# EAGLE design fb_relais_8_230V_83a (EAGLE 5.01)
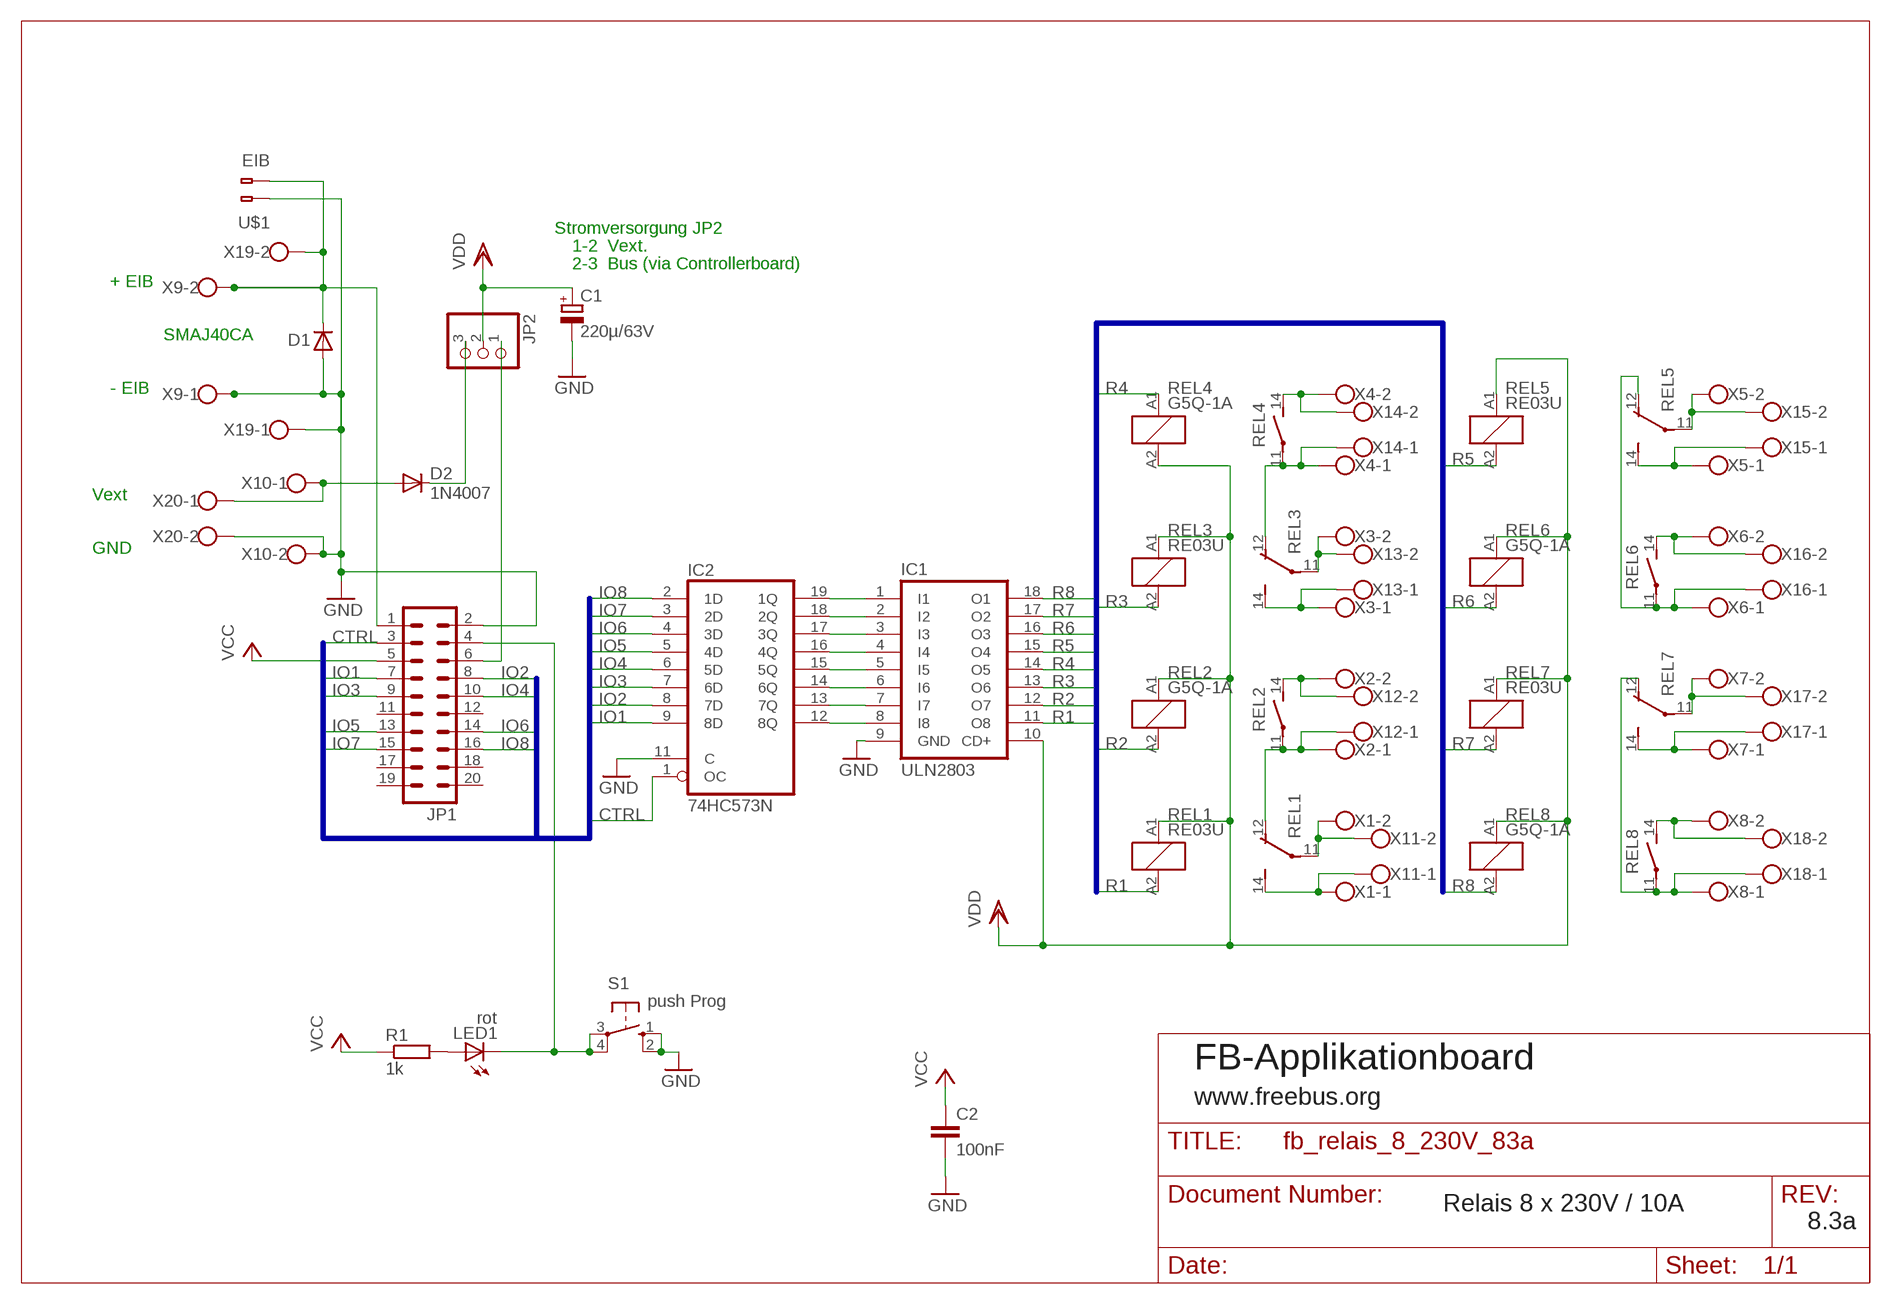
[diagram p0: schematic, sheet 1]

## Parts
C1  220µ/63V  CPOL-EUE5-10.5  [E5-10,5]
C2  100nF  C-EU050-024X044  [C050-024X044]
D1  D-  [SMA]
D2  1N4007  1N4004  [DO41-10]
IC1  ULN2803  ULN2803A  [DIL18]
IC2  74HC573N  [DIL20]
JP1  ML20  [ML20]
JP2  PINHD-1X3  [1X03]
LED1  rot  LED3MM  [LED3MM]
R1  1k  R-EU_0207/10  [0207/10]
REL1  RE03U  [G5Q_1_EU]
REL2  G5Q-1A  RE030024  [RE-SCHRACK]
REL3  RE03U  [G5Q_1_EU]
REL4  G5Q-1A  RE030024  [RE-SCHRACK]
REL5  RE03U  [G5Q_1_EU]
REL6  G5Q-1A  RE030024  [RE-SCHRACK]
REL7  RE03U  [G5Q_1_EU]
REL8  G5Q-1A  RE030024  [RE-SCHRACK]
S1  push Prog  10-XX  [B3F-10XX]
U$1  EIB  [BUSKLEMME243-724]
X1  W237-102  [W237-102]
X2  W237-102  [W237-102]
X3  W237-102  [W237-102]
X4  W237-102  [W237-102]
X5  W237-102  [W237-102]
X6  W237-102  [W237-102]
X7  W237-102  [W237-102]
X8  W237-102  [W237-102]
X9  W237-102  [W237-102]
X10  W237-102  [W237-102]
X11  W237-102AKL007-2P  [AKL007-02]
X12  W237-102AKL007-2P  [AKL007-02]
X13  W237-102AKL007-2P  [AKL007-02]
X14  W237-102AKL007-2P  [AKL007-02]
X15  W237-102AKL007-2P  [AKL007-02]
X16  W237-102AKL007-2P  [AKL007-02]
X17  W237-102AKL007-2P  [AKL007-02]
X18  W237-102AKL007-2P  [AKL007-02]
X19  W237-102AKL007-2P  [AKL007-02]
X20  W237-102AKL007-2P  [AKL007-02]

## Nets
CTRL: IC2.1(OC) JP1.3
GND: C1.- C2.2 D1.2(A) IC1.9(GND) IC2.11(C) JP1.2 S1.1(S) S1.2(S1) U$1.1(B-1) X9.1 X10.2 X19.1 X20.2
IO1: IC2.9(8D) JP1.7
IO2: IC2.8(7D) JP1.8
IO3: IC2.7(6D) JP1.9
IO4: IC2.6(5D) JP1.10
IO5: IC2.5(4D) JP1.13
IO6: IC2.4(3D) JP1.14
IO7: IC2.3(2D) JP1.15
IO8: IC2.2(1D) JP1.16
N$1 [230Vac]: REL2.14(2:S) X2.2 X12.2
N$2 [230Vac]: REL3.12(14:O) REL4.11(2:P) X4.1 X14.1
N$3 [230Vac]: REL3.14(14:S) X3.1 X13.1
N$4 [230Vac]: REL3.11(14:P) X3.2 X13.2
N$5 [230Vac]: REL8.14(2:S) X8.2 X18.2
N$6 [230Vac]: REL1.12(14:O) REL2.11(2:P) X2.1 X12.1
N$7 [230Vac]: REL1.14(14:S) X1.1 X11.1
N$8 [230Vac]: REL1.11(14:P) X1.2 X11.2
N$9 [230Vac]: REL5.12(14:O) REL6.11(2:P) X6.1 X16.1
N$11 [230Vac]: REL7.11(14:P) X7.2 X17.2
N$12 [230Vac]: REL6.14(2:S) X6.2 X16.2
N$13 [230Vac]: REL5.11(14:P) X5.2 X15.2
N$14 [230Vac]: REL5.14(14:S) X5.1 X15.1
N$15 [230Vac]: REL7.14(14:S) X7.1 X17.1
N$16 [230Vac]: REL7.12(14:O) REL8.11(2:P) X8.1 X18.1
N$17: D2.A X10.1 X20.1
N$20: D1.1(C) JP1.1 U$1.2(B-2) X9.2 X19.2
N$25: D2.C JP2.3
N$27: JP1.4 LED1.K(C) S1.3(P) S1.4(P1)
N$28: LED1.A R1.2
N$29: JP1.6 JP2.1
N$30: IC1.1(I1) IC2.19(1Q)
N$31: IC1.2(I2) IC2.18(2Q)
N$32: IC1.3(I3) IC2.17(3Q)
N$33: IC1.4(I4) IC2.16(4Q)
N$34: IC1.5(I5) IC2.15(5Q)
N$36: IC1.6(I6) IC2.14(6Q)
N$37: IC1.7(I7) IC2.13(7Q)
N$38: IC1.8(I8) IC2.12(8Q)
N$39 [230Vac]: REL4.14(2:S) X4.2 X14.2
R1: IC1.11(O8) REL1.A2
R2: IC1.12(O7) REL2.A2
R3: IC1.13(O6) REL3.A2
R4: IC1.14(O5) REL4.A1
R5: IC1.15(O4) REL5.A2
R6: IC1.16(O3) REL6.A2
R7: IC1.17(O2) REL7.A2
R8: IC1.18(O1) REL8.A2
VCC: C2.1 JP1.5 R1.1
VDD: C1.+ IC1.10(CD+) JP2.2 REL1.A1 REL2.A1 REL3.A1 REL4.A2 REL5.A1 REL6.A1 REL7.A1 REL8.A1
Unconnected: JP1.11 JP1.12 JP1.17 JP1.18 JP1.19 JP1.20

## Buses
R[1..8]
IO[1..8],CTRL

## Notes on the sheet
- Stromversorgung JP2
- 1-2  Vext.
- 2-3  Bus (via Controllerboard)
- + EIB
- SMAJ40CA
- - EIB
- Vext
- GND
- FB-Applikationboard
- www.freebus.org
- Relais 8 x 230V / 10A
- 8.3a

## Power pins joined to a net without a drawn wire
GND: IC2.10(GND)
VCC: IC2.20(VCC)

## Library data of the parts
C1 = rcl:CPOL-EU: POLARIZED CAPACITOR, European symbol
C2 = rcl:C-EU: CAPACITOR, European symbol
D1 = semicon-smd-ipc:D-: DIODE unfilled
D2 = diode:1N4004: DIODE general purpose rectifier, 1 A
IC1 = uln-udn:ULN2803A: DRIVER ARRAY
IC2 = 74xx-eu:74*573: 8-bit D latch BUS DRIVER
JP1 = con-harting-ml:ML20: HARTING
JP2 = pinhead:PINHD-1X3: PIN HEADER
LED1 = led:LED: LED OSRAM: - CHIPLED LG R971, LG N971, LY N971, LG Q971, LY Q971, LO R971, LY R971 LH N974, LH R974 LS Q976, LO Q976, LY Q976 LO Q996 - Hyper CHIPLED LW Q18S LB Q993, LB Q99A, LB R99A - SideLED LS A670, LO A670, LY A670, LG A670, LP A670 LB A673, LV A673, LT A673, LW A673 LH A674 LY A675 LS A676, LA A676, LO A676, LY A676, LW A676 LS A679, LY A679, LG A679 - Hyper Micro SIDELED® LS Y876, LA Y876, LO Y876, LY Y876 LT Y87S - SmartLED LW L88C, LW L88S LB L89C, LB L89S, LG L890 LS L89K, LO L89K, LY L89K LS L896, LA L896, LO L896, LY L896 - TOPLED LS T670, LO T670, LY T670, LG T670, LP T670 LSG T670, LSP T670, LSY T670, LOP T670, LYG T670 LG T671, LOG T671, LSG T671 LB T673, LV T673, LT T673, LW T673 LH T674 LS T676, LA T676, LO T676, LY T676, LB T676, LH T676, LSB T676, LW T676 LB T67C, LV T67C, LT T67C, LS T67K, LO T67K, LY T67K, LW E67C LS E67B, LA E67B, LO E67B, LY E67B, LB E67C, LV E67C, LT E67C LW T67C LS T679, LY T679, LG T679 LS T770, LO T770, LY T770, LG T770, LP T770 LB T773, LV T773, LT T773, LW T773 LH T774 LS E675, LA E675, LY E675, LS T675 LS T776, LA T776, LO T776, LY T776, LB T776 LHGB T686 LT T68C, LB T68C - Hyper Mini TOPLED® LB M676 - Mini TOPLED Santana® LG M470 LS M47K, LO M47K, LY M47K Source: http://www.osram.convergy.de - LUMILED® LXK2-PW12-R00, LXK2-PW12-S00, LXK2-PW14-U00, LXK2-PW14-V00 LXK2-PM12-R00, LXK2-PM12-S00, LXK2-PM14-U00 LXK2-PE12-Q00, LXK2-PE12-R00, LXK2-PE12-S00, LXK2-PE14-T00, LXK2-PE14-U00 LXK2-PB12-K00, LXK2-PB12-L00, LXK2-PB12-M00, LXK2-PB14-N00, LXK2-PB14-P00, LXK2-PB14-Q00 LXK2-PR12-L00, LXK2-PR12-M00, LXK2-PR14-Q00, LXK2-PR14-R00 LXK2-PD12-Q00, LXK2-PD12-R00, LXK2-PD12-S00 LXK2-PH12-R00, LXK2-PH12-S00 LXK2-PL12-P00, LXK2-PL12-Q00, LXK2-PL12-R00 Source: www.luxeon.com
R1 = rcl:R-EU_: RESISTOR, European symbol
REL1 REL3 REL5 REL7 = freebus_relay:RE03U
REL2 REL4 REL6 REL8 = relay:RE03*: Miniature PCB Relay 1 pole 6 A SCHRACK Source: http://www.schrack.com/.. 5812.pdf
S1 = switch-omron:10-XX: OMRON SWITCH
U$1 = con-wago:EIB
X1-X20 = con-wago-500:W237-102: WAGO SCREW CLAMP

## Net classes
0 SELV: width 0.406 mm
1 230Vac: width 1.93 mm, clearance 5.08 mm to class 0, clearance 1.905 mm

## Board
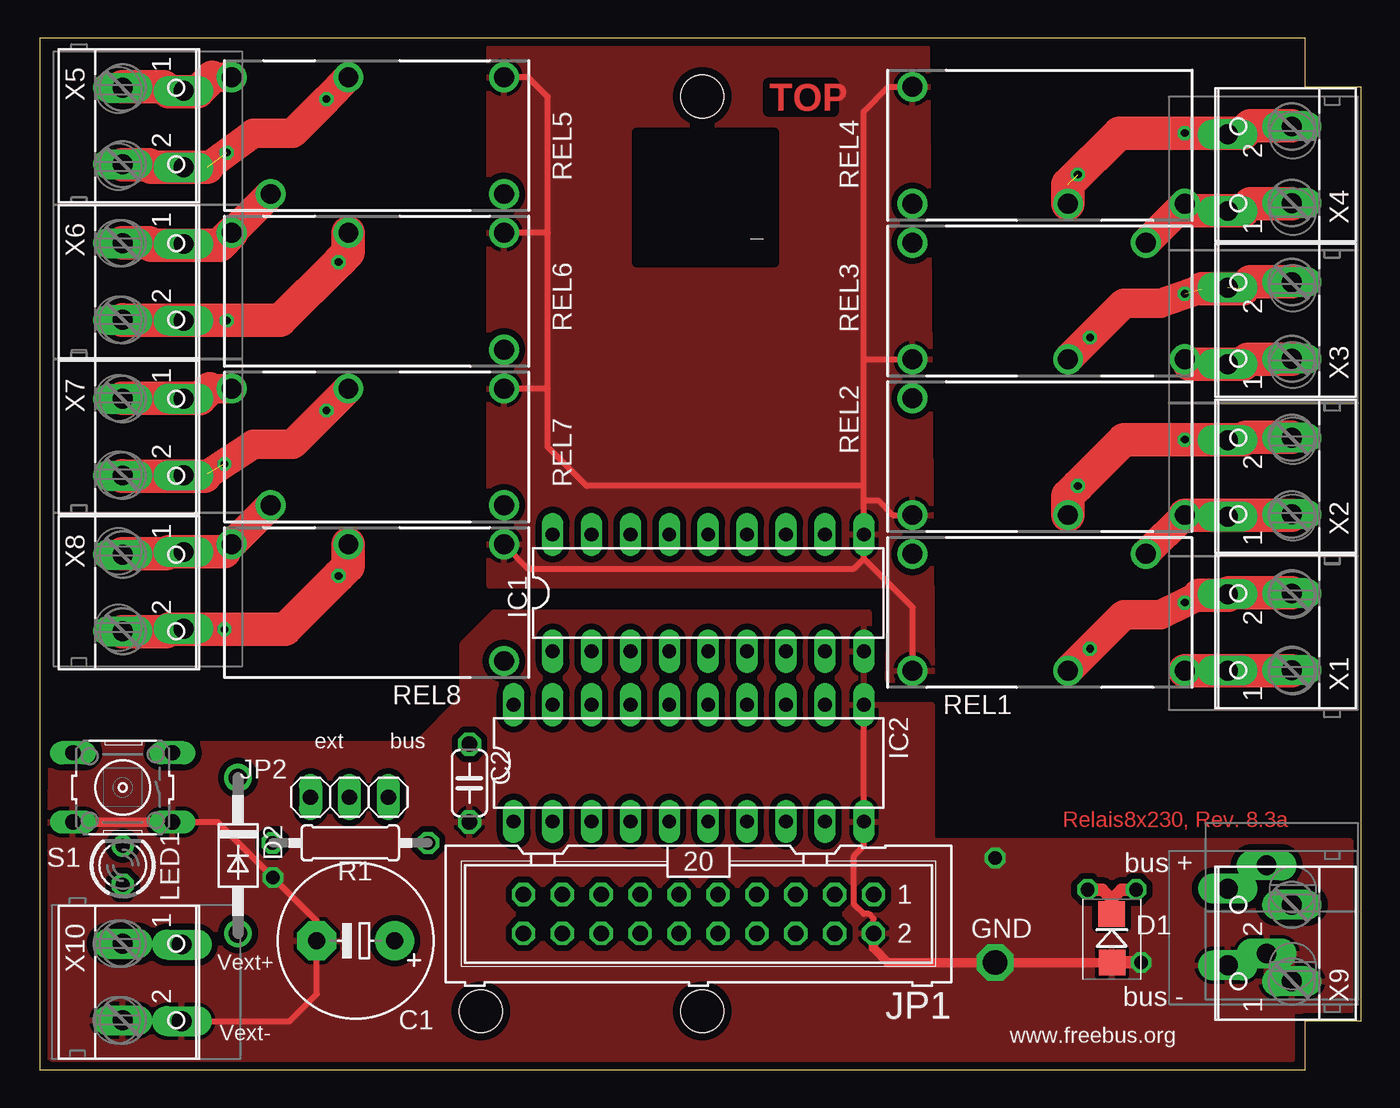
[diagram p1: board, top side]
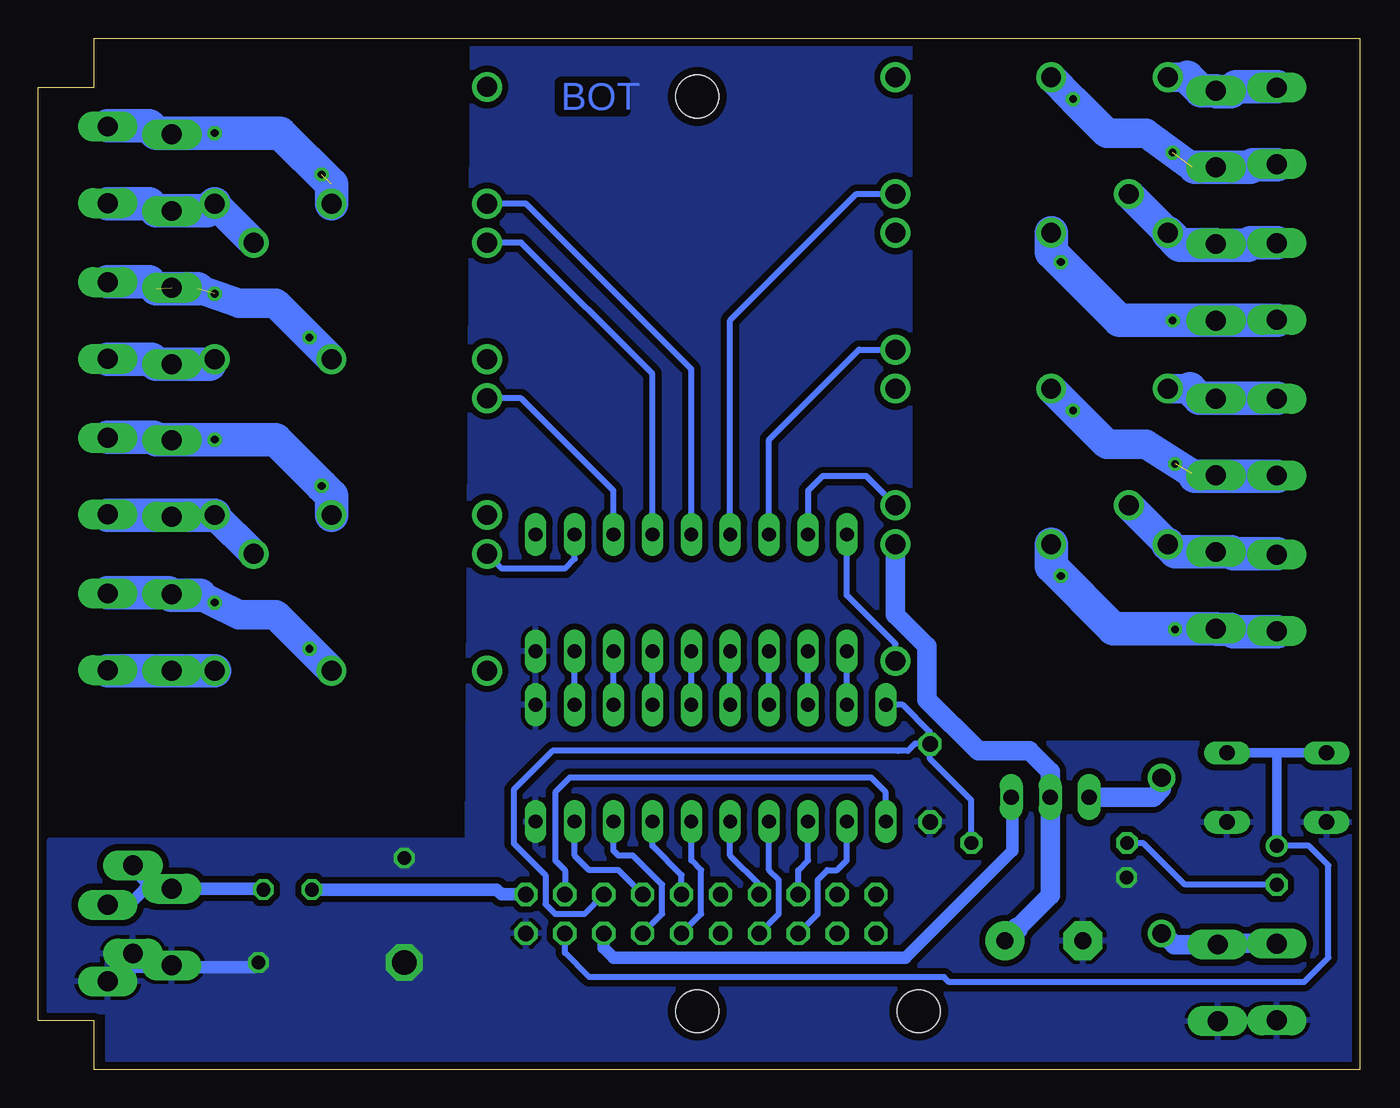
[diagram p2: board, bottom side, seen from below]

Size 86.28 x 67.31 mm. Coordinates in mm from the lower left corner, seen from the top.
Outline: 0,0.01 82.64,0 82.64,3.18 86.28,3.18 86.28,64.13 82.64,64.13 82.64,67.31 0,67.31 0,0.01
Copper layers (1*16): Top 0.035mm / dielectric 1.5mm / Bottom 0.035mm
Design rules "default": minimum track width 10mil, minimum drill 24mil, track to track 16mil, track to pad 12mil, pad to pad 16mil, via to via 16mil, smd to smd 8mil, copper to edge 20mil, drill to drill 10mil, minimum pad ring 10mil, minimum via ring 8mil, stop-mask expansion 4mil, vias tented up to drill 0mil, thermal gap 10mil
Holes 2.8 mm at 43.27,3.81 43.27,63.5 28.79,3.81
tRestrict: area 39,52.7 to 48,61.2

### Footprints (pad centres in the part's own frame; a part is rotated, then mirrored left to right if it is on the bottom)
E5-10,5 = drill 1.1 pad 2.54 round: + -2.54,0 | drill 1.1 pad 2.54 octagon: - 2.54,0
C050-024X044 = drill 1 octagon: 1 -2.54,0; 2 2.54,0
SMA = smd 1.67 x 1.73: 1 -1.576,0; 2 1.58,0.014
DO41-10 = drill 1.2 round: A 5.08,0; C -5.08,0
DIL18 = drill 0.9 long: 1 -10.16,-3.81; 2 -7.62,-3.81; 3 -5.08,-3.81; 4 -2.54,-3.81; 5 0,-3.81; 6 2.54,-3.81; 7 5.08,-3.81; 8 7.62,-3.81; 9 10.16,-3.81; 10 10.16,3.81; 11 7.62,3.81; 12 5.08,3.81; 13 2.54,3.81; 14 0,3.81; 15 -2.54,3.81; 16 -5.08,3.81; 17 -7.62,3.81; 18 -10.16,3.81
DIL20 = drill 0.9 long: 1 -11.43,-3.81; 2 -8.89,-3.81; 3 -6.35,-3.81; 4 -3.81,-3.81; 5 -1.27,-3.81; 6 1.27,-3.81; 7 3.81,-3.81; 8 6.35,-3.81; 9 8.89,-3.81; 10 11.43,-3.81; 11 11.43,3.81; 12 8.89,3.81; 13 6.35,3.81; 14 3.81,3.81; 15 1.27,3.81; 16 -1.27,3.81; 17 -3.81,3.81; 18 -6.35,3.81; 19 -8.89,3.81; 20 -11.43,3.81
ML20 = drill 1 octagon: 1 -11.43,-1.27; 2 -11.43,1.27; 3 -8.89,-1.27; 4 -8.89,1.27; 5 -6.35,-1.27; 6 -6.35,1.27; 7 -3.81,-1.27; 8 -3.81,1.27; 9 -1.27,-1.27; 10 -1.27,1.27; 11 1.27,-1.27; 12 1.27,1.27; 13 3.81,-1.27; 14 3.81,1.27; 15 6.35,-1.27; 16 6.35,1.27; 17 8.89,-1.27; 18 8.89,1.27; 19 11.43,-1.27; 20 11.43,1.27
1X03 = drill 1 long: 1 -2.54,0; 2 0,0; 3 2.54,0
LED3MM = drill 0.9 octagon: A -1.27,0 | drill 0.9 round: K 1.27,0
0207/10 = drill 0.9 octagon: 1 -5.08,0; 2 5.08,0
G5Q_1_EU = drill 1.3 round: 11 1.27,-3.81; 12 6.35,3.81; 14 8.89,-3.81; A1 -8.89,-3.81; A2 -8.89,3.81
RE-SCHRACK = drill 1.3 round: 11 8.89,-3.81; 14 1.27,-3.81; A1 -8.89,-3.81; A2 -8.89,3.81
B3F-10XX = drill 1 long: 1 -3.251,2.261; 2 3.251,2.261; 3 -3.251,-2.261; 4 3.251,-2.261
BUSKLEMME243-724 = drill 1.3 long: 1 -2.875,0; 2 2.875,0
W237-102 = drill 1.3 long: 1 -2.5,-1.27; 2 2.5,-1.27
AKL007-02 = drill 1.3 long: 1 -2.45,2.325; 2 2.55,2.325

### Placement (x,y rotation side)
C1  20.63,8.41 180 top
C2  28.06,18.7 270 top
D1  70,8.57 270 top
D2  12.95,13.97 270 top
IC1  43.65,31.12 0 top
IC2  42.38,20 0 top
JP1  43.02,10.16 180 top
JP2  20.22,17.78 180 top
LED1  5.42,13.33 90 top
R1  20.28,14.8 180 top
REL1  65.88,29.85 0 top
REL2  65.88,40 0 top
REL3  65.88,50.16 0 top
REL4  65.88,60.32 0 top
REL5  21.42,60.96 180 top
REL6  21.42,50.8 180 top
REL7  21.42,40.64 180 top
REL8  21.42,30.48 180 top
S1  5.42,18.42 180 top
U$1  80.11,10.45 90 top
X1  80.48,28.58 90 top
X2  80.48,38.73 90 top
X3  80.48,48.89 90 top
X4  80.48,59.05 90 top
X5  6.69,61.59 270 top
X6  6.69,51.43 270 top
X7  6.69,41.27 270 top
X8  6.69,31.12 270 top
X9  80.48,8.26 90 top
X10  6.69,5.71 270 top
X11  79.89,28.49 90 top
X12  79.89,38.53 90 top
X13  79.89,48.49 90 top
X14  79.89,58.49 90 top
X15  7.07,61.43 270 top
X16  7.07,51.43 270 top
X17  7.07,41.34 270 top
X18  7.07,31.34 270 top
X19  79.9,9.25 90 top
X20  6.96,5.71 270 top

### Tracks (layer width: path | path; a pad name or v marks a point on that pad's centre or on a via)
CTRL
  Bottom 0.406: IC2.1 30.95,18.1 31.9,19.05 51.59,19.05 52.54,18.1 52.54,13.65 51.91,13.02 JP1.3
GND  (via drill 0.9, 1.6)
  Top 0.406: S1.1 11.62,16.15 18.09,9.68 C1.- | X20.2 16.34,3.17 18.09,4.92 C1.- | JP1.2 54.45,9.84 54.13,10.16 53.81,10.16 53.17,10.79 53.17,13.97 53.81,14.61 IC2.10 IC2.11 | C1.-
  Top 0.61: 2.02,16.15 S1.2 S1.1 | S1.1 8.73,16.15 8.73,16.19 8.69,16.15 S1.1 | JP1.2 54.45,7.94 55.4,6.98 v62.38,6.98 70,6.98 D1.2
  Top 0.813: 2.02,16.15 1.74,15.88 | D1.2 v71.9,6.99 v71.91,6.98
  Bottom 0.406: 9.36,3.17 9.2,3.17 9.16,3.21 X10.2
  Bottom 0.61: 9.36,3.17 9.35,3.17 X20.2
  Bottom 0.813: X19.1 77.62,6.76 77.62,6.67 72.22,6.67 v71.91,6.98 | 80,6.83 | X9.1 81.08,5.75 80,6.83
  Bottom 1.016: X19.1 79.03,6.8 79.84,7.62 79.84,7.58 U$1.1 80.11,7.36 | 80,6.83 79.21,6.83
  other vias: 15.23,12.54 62.38,13.81
  pour Bottom (isolate 0.305): 0.47,21.27 27.93,21.27 27.93,24.61 29.36,24.61 29.36,66.68 57.94,66.68 58.25,14.92 85.56,14.92 85.56,3.81 81.75,3.81 81.75,0.64 0.47,0.64
  pour Top (isolate 0.305): 0.79,21.27 24.6,21.27 27.62,24.29 27.62,27.78 29.68,29.85 54.13,29.85 54.13,23.81 58.25,23.81 58.25,14.92 85.56,14.92 85.56,3.81 81.75,3.81 81.75,0.64 1.1,0.64 arc-90 0.47,1.27
IO1
  Bottom 0.406: JP1.7 48.41,13.02 50.32,13.02 51.27,13.97 IC2.9
IO2
  Bottom 0.406: JP1.8 45.55,10.16 45.55,12.06 47.46,13.97 48.41,13.97 48.73,14.29 IC2.8
IO3
  Bottom 0.406: JP1.9 44.28,12.7 46.19,14.61 IC2.7
IO4
  Bottom 0.406: JP1.10 43.02,10.16 43.02,13.02 43.65,13.65 IC2.6
IO5
  Bottom 0.406: JP1.13 39.2,12.06 41.11,13.97 IC2.5
IO6
  Bottom 0.406: JP1.14 37.94,10.16 37.94,12.38 38.57,13.02 IC2.4
IO7
  Bottom 0.406: JP1.15 36.66,13.02 36.03,13.65 IC2.3
IO8
  Bottom 0.406: JP1.16 35.39,10.16 35.39,12.38 34.76,13.02 34.12,13.02 33.49,13.65 IC2.2
N$1  (via drill 0.5)
  Top 1.93: 81.75,41.27 X2.2
  Top 2.184: REL2.14 67.14,37.46 v67.78,38.1 70.8,41.12 v74.77,41.12 78.58,41.12 78.73,41.27 81.75,41.27
  Bottom 1.93: 77.46,41.12 77.5,41.09 X12.2 | X2.2 81.75,41.27
  Bottom 2.184: REL2.14 67.14,37.46 v67.78,38.1 70.8,41.12 v74.77,41.12 77.46,41.12 | 77.62,41.12 78.58,41.12 78.73,41.27 81.75,41.27
N$2
  Top 1.93: REL3.12 REL4.11 75.24,56.04 | 77.62,56.04 X14.1 | 81.75,56.52 X4.1
  Top 2.184: 75.24,56.04 X14.1 78.58,56.04 79.05,56.52 81.75,56.52
  Bottom 1.93: REL3.12 REL4.11
  Bottom 2.184: REL4.11 75.24,56.04 78.58,56.04 79.05,56.52 81.75,56.52
N$3
  Top 1.93: X13.1 77.62,46.04 | REL3.14 75.08,46.04 | 81.75,46.35 X3.1
  Top 2.184: 75.08,46.04 X13.1 78.58,46.04 78.89,46.35 81.75,46.35
  Bottom 1.93: 75.08,46.04 REL3.14
  Bottom 2.184: 75.08,46.04 78.58,46.04 78.89,46.35 81.75,46.35
N$4  (via drill 0.5)  (2 unrouted)
  Top 1.93: REL3.11 v68.57,47.78 70.8,50.01 73.18,50.01 75.88,50.96 | 81.75,51.43 X3.2
  Top 2.184: 75.88,50.96 78.58,50.96 79.05,51.43 81.75,51.43
  Bottom 1.93: REL3.11 v68.57,47.78 70.8,50.01 73.18,50.01 75.88,50.96
  Bottom 2.184: 75.88,50.96 78.58,50.96 79.05,51.43 81.75,51.43
  other vias: 74.77,50.64
N$5  (via drill 0.5)
  Top 1.93: 5.39,28.58 X8.2
  Top 2.184: REL8.14 20.15,32.86 v19.52,32.23 16.03,28.73 v12.06,28.73 8.41,28.73 8.25,28.58 5.39,28.58
  Bottom 1.93: 5.39,28.58 X8.2
  Bottom 2.184: X18.2 16.08,28.79 20.15,32.86 REL8.14 | 9.36,28.73 8.41,28.73 8.25,28.58 5.39,28.58
N$6
  Top 1.93: REL1.12 REL2.11 | 77.61,36.2 X12.1 | X2.1 81.75,36.2 | 78.58,36.2 78.73,36.2
  Top 2.184: REL2.11 77.61,36.2 | 77.61,36.2 77.62,36.2 | 77.61,36.2 78.58,36.2 | 78.73,36.2 81.75,36.2
  Bottom 1.93: REL1.12 REL2.11 | 81.75,36.2 X2.1
  Bottom 2.184: REL2.11 81.75,36.2
N$7
  Top 1.93: 77.62,26.04 X11.1 | 81.75,26.04 X1.1
  Top 2.184: REL1.14 X11.1 81.75,26.04
  Bottom 2.184: REL1.14 81.75,26.04
N$8  (via drill 0.5)
  Top 1.93: REL1.11 v68.57,27.46 70.8,29.69 73.02,29.69 | X1.2 81.75,31.12 | 75.72,30.96 v74.77,30.48 73.18,29.69 | X11.2 77.56,31.02 77.62,30.96
  Top 2.184: X11.2 77.64,31.12 81.75,31.12 | 75.72,30.96 77.62,30.96
  Bottom 1.93: REL1.11 v68.57,27.46 70.8,29.69 73.18,29.69 v74.77,30.48 75.72,30.96 | 81.75,31.12 X1.2
  Bottom 2.184: 75.72,30.96 77.62,30.96 77.78,31.12 81.75,31.12
N$9
  Top 1.93: REL5.12 REL6.11 11.9,53.98 | 9.33,53.82 X16.1 9.36,53.85 9.36,53.82 | 5.39,53.98 5.39,53.97 X6.1
  Top 2.184: 9.33,53.82 7.3,53.82 7.14,53.98 5.39,53.98 | 9.36,53.82 11.74,53.82 REL6.11
  Bottom 1.93: REL6.11 REL5.12 | X16.1 9.36,53.92 9.36,53.98 11.58,53.98 11.74,53.82
  Bottom 2.184: 5.39,53.98 7.14,53.98 7.3,53.82 11.74,53.82 REL6.11
N$11  (via drill 0.5)  (1 unrouted)
  Top 1.93: REL7.11 v18.73,43.02 16.5,40.8 13.96,40.8 10.79,38.73 | 9.36,38.73 9.36,38.75 X17.2 | 5.39,38.74 5.39,38.73
  Top 2.184: 10.79,38.73 9.36,38.73 5.39,38.73 | X7.2 5.39,38.74
  Bottom 1.93: REL7.11 v18.73,43.02 16.5,40.8 13.96,40.8 10.95,38.89 10.79,38.73 | 9.36,38.73 9.36,38.75 X17.2
  Bottom 2.184: 10.79,38.73 9.36,38.73 5.39,38.73
  other vias: 12.06,39.53
N$12  (via drill 0.5)
  Top 1.93: 9.36,48.89 9.38,48.89 X16.2 | 5.39,48.9 5.39,48.89
  Top 2.184: REL6.14 20.15,53.34 v19.52,52.7 15.71,48.89 v12.22,48.89 9.38,48.89 5.39,48.89 | X6.2 5.39,48.9
  Bottom 2.184: REL6.14 20.15,53.34 15.71,48.89 v12.22,48.89 5.39,48.89
N$13  (via drill 0.5)  (1 unrouted)
  Top 1.93: REL5.11 v18.73,63.34 16.5,61.12 13.96,61.12 10.95,58.9 | 5.39,59.05 5.39,59.06 X5.2
  Top 2.184: 10.95,58.9 7.3,58.9 7.14,59.05 5.39,59.05
  Bottom 1.93: 10.79,58.88 10.94,58.88 | REL5.11 v18.73,63.34 16.5,61.12 13.96,61.12 10.95,58.9 10.79,58.9 10.79,58.88 | 9.38,58.9 X15.2 | 10.79,58.88 10.78,58.9
  Bottom 2.184: 10.78,58.9 9.38,58.9 7.14,58.9 6.98,59.05 5.39,59.05
  other vias: 12.22,59.85
N$14
  Top 1.93: 11.27,64.77 REL5.14 | 5.39,64.14 X5.1
  Top 2.184: 11.27,64.77 10.31,63.82 8.41,63.82 8.09,64.14 5.39,64.14
  Bottom 1.93: REL5.14 11.27,64.77 | X15.1 arc-125 9.36,63.82
  Bottom 2.184: X15.1 10.38,63.88 11.27,64.77 | 5.39,64.14 8.09,64.14 8.41,63.82 9.36,63.82
N$15
  Top 1.93: REL7.14 11.11,44.45 | 9.36,43.81 9.37,43.81 X17.1 | 5.39,43.81 X7.1
  Top 2.184: 10.44,43.78 10.41,43.81 10.31,43.81 | 10.31,43.81 9.37,43.81 5.39,43.81 | 10.31,43.81 10.47,43.81 11.11,44.45
  Bottom 1.93: 11.11,44.45 REL7.14 | 5.39,43.81 X7.1
  Bottom 2.184: 11.11,44.45 10.47,43.81 5.39,43.81
N$16
  Top 1.93: 12.06,33.81 REL7.12 | 5.39,33.66 5.39,33.65 X8.1
  Top 2.184: 12.06,33.81 8.41,33.81 8.25,33.66 5.39,33.66
  Bottom 1.93: REL7.12 REL8.11
  Bottom 2.184: REL8.11 12.03,33.78 X18.1 8.38,33.78 8.25,33.66 5.39,33.66
N$17
  Bottom 0.61: 9.04,8.26 9.13,8.17 X20.1
  Bottom 0.813: 5.39,8.26 X10.1
  Bottom 1.27: 5.39,8.26 9.04,8.26 | D2.A 12.85,8.89 12.13,8.17 X20.1
N$20  (via drill 0.9)
  Top 0.813: 70,11.11 D1.1 | 70,11.11 69.37,11.75 v68.41,11.75 | v71.59,11.75 70.64,11.75 70,11.11
  Bottom 0.813: X19.2 71.65,11.8 v71.59,11.75 | v68.41,11.75 56.35,11.75 56.03,11.43 JP1.1 | 78.42,11.8 78.42,11.75 79.37,11.75 80.36,10.75 X9.2
  Bottom 1.016: U$1.2 80.16,13.33 78.63,11.8 78.42,11.8 X19.2
N$25
  Bottom 1.27: D2.C 12.95,18.32 13.49,17.78 JP2.3
N$27
  Bottom 0.406: LED1.K 3.33,14.61 2.06,13.33 2.06,7.3 3.64,5.71 26.82,5.71 27.14,6.03 50.32,6.03 51.91,7.62 JP1.4
  Bottom 0.61: 8.69,20.68 8.73,20.68 8.73,20.64 8.69,20.68 | 8.69,20.68 S1.3 | 5.42,20.68 S1.4 | 5.42,20.68 8.69,20.68 | LED1.K 5.42,20.68
N$28
  Bottom 0.406: LED1.A 11.42,12.06 14.12,14.76 15.23,14.76 R1.2 | R1.2
N$29
  Bottom 0.813: JP1.6 49.37,7.94 48.73,7.3 29.68,7.3 22.7,14.29 22.7,17.78 JP2.1
N$30
  Bottom 0.406: IC2.19 IC1.1
N$31
  Bottom 0.406: IC2.18 IC1.2
N$32
  Bottom 0.406: IC2.17 IC1.3
N$33
  Bottom 0.406: IC2.16 IC1.4
N$34
  Bottom 0.406: IC2.15 IC1.5
N$36
  Bottom 0.406: IC2.14 IC1.6
N$37
  Bottom 0.406: IC2.13 IC1.7
N$38
  Bottom 0.406: IC2.12 IC1.8
N$39  (via drill 0.5)  (1 unrouted)
  Top 1.93: 81.75,61.59 X4.2
  Top 2.184: REL4.14 67.14,57.78 70.48,61.12 v74.77,61.12 78.58,61.12 79.05,61.59 81.75,61.59
  Bottom 1.93: 77.48,61.12 X14.2 | X4.2 81.75,61.59
  Bottom 2.184: REL4.14 67.14,57.78 70.48,61.12 v74.77,61.12 77.48,61.12 | 77.62,61.12 78.58,61.12 79.05,61.59 81.75,61.59
  other vias: 67.78,58.42
R1
  Bottom 0.406: REL1.A2 56.03,32.7 51.91,32.7 51.27,33.34 IC1.11
R2
  Bottom 0.406: IC1.12 48.73,37.78 54.76,43.81 REL2.A2
R3
  Bottom 0.406: IC1.13 46.19,45.4 54.76,53.98 REL3.A2
R4
  Bottom 0.406: IC1.14 43.65,45.72 54.45,56.52 REL4.A1
R5
  Bottom 0.406: IC1.15 41.11,48.89 32.85,57.15 REL5.A2
R6
  Bottom 0.406: IC1.16 38.57,41.12 32.7,46.99 REL6.A2
R7
  Bottom 0.406: IC1.17 36.03,37.78 35.08,38.73 32.22,38.73 REL7.A2
R8
  Bottom 0.406: REL8.A2 30.31,27.78 33.49,30.96 IC1.18
VCC
  Bottom 0.406: JP1.5 50.63,10.16 52.54,10.16 53.17,10.79 53.17,12.7 55.24,14.76 55.24,18.26 52.7,20.8 30.16,20.8 | 30.16,20.8 | 30.16,20.8 | IC2.20 29.84,23.81 28.09,22.07 28.09,21.27 | C2.1 28.09,21.27 | C2.1 | 28.09,21.27 29.04,21.27 29.52,20.8 30.16,20.8 | 30.16,20.8 | R1.1 25.36,17.59 28.06,20.29 C2.1
VDD
  Top 0.406: REL5.A1 31.9,64.77 33.17,63.5 33.17,54.61 | 33.17,54.61 REL6.A1 | 33.17,44.45 33.17,54.61 | 33.17,44.45 REL7.A1 | REL8.A1 31.9,32.7 53.17,32.7 53.81,33.34 | 53.81,33.34 IC1.10 53.81,37.15 | REL1.A1 56.98,30.16 53.81,33.34 | 53.81,37.15 53.81,38.1 | 53.81,38.1 53.81,46.35 | 53.81,46.35 53.81,62.55 55.4,64.14 REL4.A2 | REL2.A1 55.71,36.2 54.76,37.15 53.81,37.15 | 53.81,46.35 REL3.A1 | 33.17,44.45 33.17,40.64 35.71,38.1 53.81,38.1
  Bottom 1.27: 22.38,9.21 20.22,11.37 JP2.2 20.22,19.43 21.58,20.8 24.92,20.8 28.25,24.13 28.25,27.62 30.31,29.69 REL8.A1
  Bottom 1.422: C1.+ 22.38,9.21
  pour Top (isolate 0.305): 29.36,66.68 57.94,66.68 58.25,25.4 55.4,25.4 55.56,31.59 29.36,31.59

### Text on the board
Top: TOP | Relais8x230, Rev. 8.3a
Bottom: BOT
tPlace: ext | bus | bus + | Vext+ | bus - | Vext-
tNames: REL4 | GND | www.freebus.org
Document: A5 | A4 | A6 | A3 | A7 | A2 | A8 | A1 | EIB + | Vext+ | EIB - | Vext-
Drill_legend: Bohrlegende | Datum: 10.01.2009 22:11:37 | 2.8000 mm / 110.236 mil | 1.6000 mm / 62.992 mil | 1.3000 mm / 51.181 mil | 1.2000 mm / 47.244 mil | 1.1000 mm / 43.307 mil | 1.0000 mm / 39.370 mil | 0.9000 mm / 35.433 mil | 0.5000 mm / 19.685 mil